# Altium project Quadcopter_REC.PrjPcb
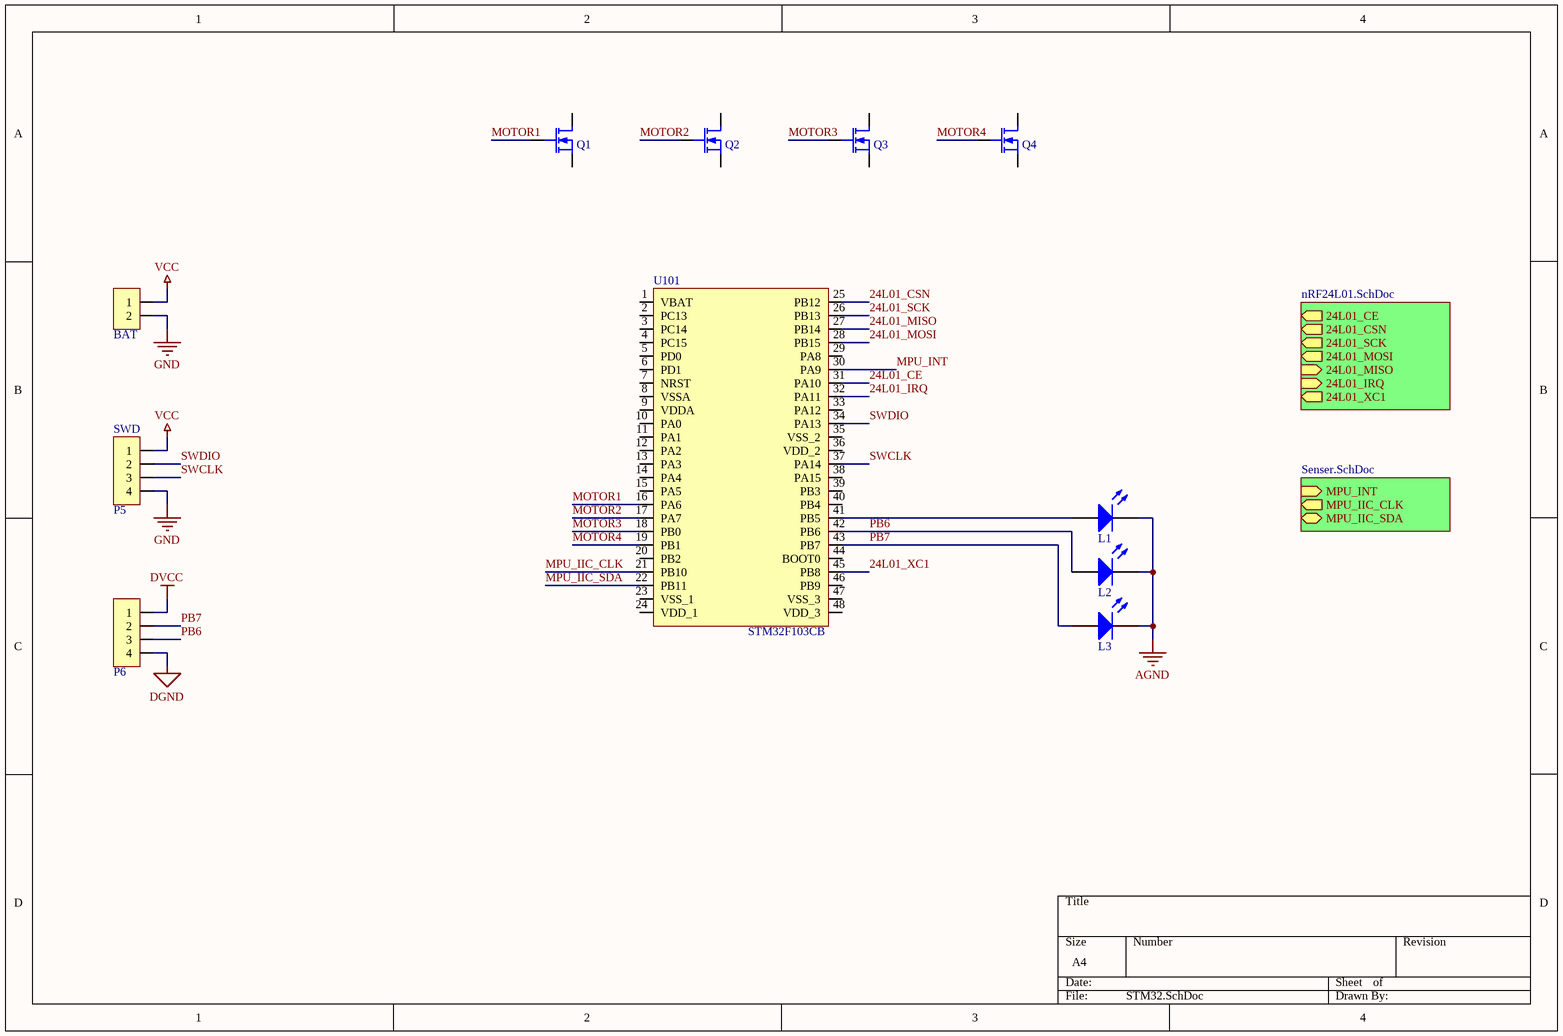
[diagram p0: STM32.SchDoc]
6 sheets, 26 parts. Net scope: hierarchical (ports join the sheet entries above them; power ports are global).
Board file: Quadcopter.PcbDoc
Sheets:
  STM32.SchDoc
    nRF24L01 = nRF24L01.SchDoc
    Senser = Senser.SchDoc
  Power.SchDoc
  Bluetooth.SchDoc
  Telecontroller.SchDoc

## Sheet STM32.SchDoc
size A4

### Parts
BAT  Port2  (value not drawn)
L1  LED  (value not drawn)
L2  LED  (value not drawn)
L3  LED  (value not drawn)
P5  SWD
P6  Port4  (value not drawn)
Q1  PWV31XN  (value not drawn)
Q2  PWV31XN  (value not drawn)
Q3  PWV31XN  (value not drawn)
Q4  PWV31XN  (value not drawn)
U101  STM32F103CB

### Sub-sheets
nRF24L01 = nRF24L01.SchDoc: 24L01_CE (out), 24L01_CSN (out), 24L01_SCK (out), 24L01_MOSI (out), 24L01_MISO (in), 24L01_IRQ (in), 24L01_XC1 (out)
Senser = Senser.SchDoc: MPU_INT (in), MPU_IIC_CLK (out), MPU_IIC_SDA (bidir)

### Nets
AGND: L1.2(K) L2.2(K) L3.2(K)
DGND: P6.4
DVCC: P6.1
GND: BAT.2 P5.4
VCC: BAT.1 P5.1
24L01_CE: U101.31(PA10)
24L01_CSN: U101.25(PB12)
24L01_IRQ: U101.32(PA11)
24L01_MISO: U101.27(PB14)
24L01_MOSI: U101.28(PB15)
24L01_SCK: U101.26(PB13)
24L01_XC1: U101.45(PB8)
MOTOR1: Q1.2(G) U101.16(PA6)
MOTOR2: Q2.2(G) U101.17(PA7)
MOTOR3: Q3.2(G) U101.18(PB0)
MOTOR4: Q4.2(G) U101.19(PB1)
MPU_IIC_CLK: U101.21(PB10)
MPU_IIC_SDA: U101.22(PB11)
MPU_INT: U101.30(PA9)
PB6: L2.1(A) P6.3 U101.42(PB6)
PB7: L3.1(A) P6.2 U101.43(PB7)
SWCLK: P5.3 U101.37(PA14)
SWDIO: P5.2 U101.34(PA13)
NetL1_1: L1.1(A) U101.41(PB5)

Not connected (* = marked no-connect by the designer): Q1 1(D) 3(S); Q2 1(D) 3(S); Q3 1(D) 3(S); Q4 1(D) 3(S); U101 1(VBAT) 2(PC13) 3(PC14) 4(PC15) 5(PD0) 6(PD1) 7(NRST) 8(VSSA) 9(VDDA) 10(PA0) 11(PA1) 12(PA2) 13(PA3) 14(PA4) 15(PA5) 20(PB2) 23(VSS_1) 24(VDD_1) 29(PA8) 33(PA12) 35(VSS_2) 36(VDD_2) 38(PA15) 39(PB3) 40(PB4) 44(BOOT0) 46(PB9) 47(VSS_3) 48(VDD_3)

### Library data of the parts
BAT = Port2: PowerSupply
P5 = Port4
U101 = STM32F103C8\CB

## Sheet nRF24L01.SchDoc
size A4
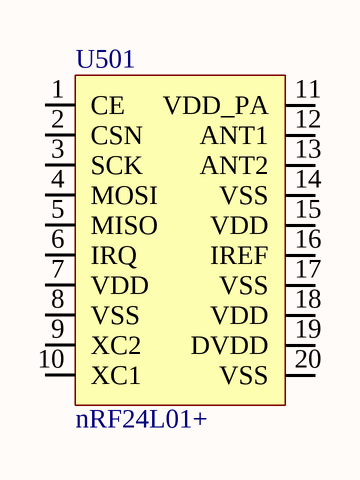
[diagram p1: nRF24L01.SchDoc]

### Parts
U501  nRF24L01+

### Nets

Not connected (* = marked no-connect by the designer): U501 1(CE) 2(CSN) 3(SCK) 4(MOSI) 5(MISO) 6(IRQ) 7(VDD) 8(VSS) 9(XC2) 10(XC1) 11(VDD_PA) 12(ANT1) 13(ANT2) 14(VSS) 15(VDD) 16(IREF) 17(VSS) 18(VDD) 19(DVDD) 20(VSS)

## Sheet Senser.SchDoc
size A4
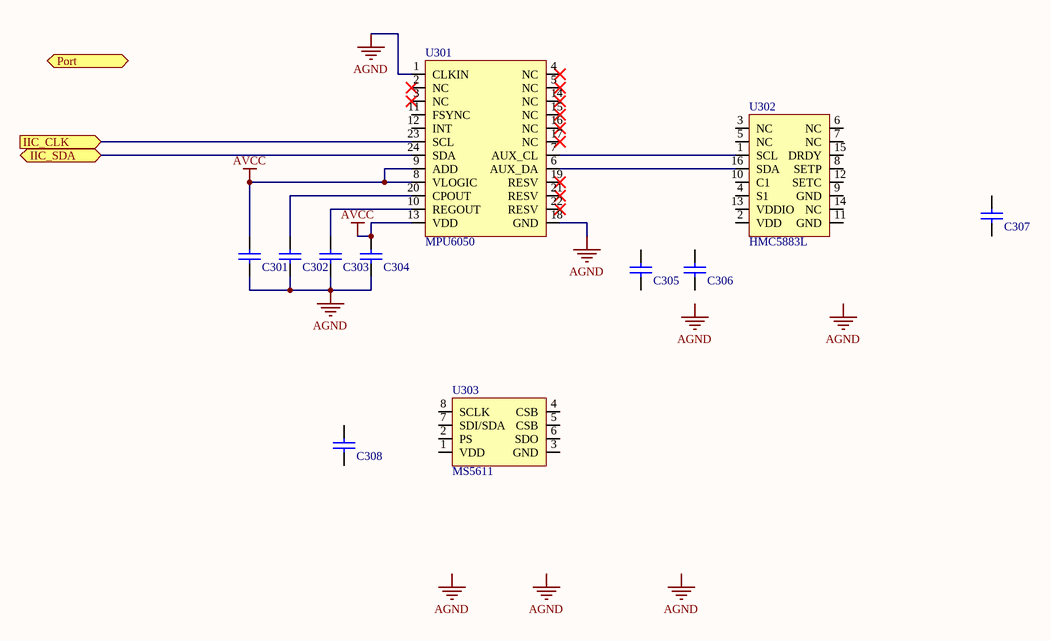
[diagram p2: Senser.SchDoc]

### Parts
C301  Cap 0603  (value not drawn)
C302  Cap 0603  (value not drawn)
C303  Cap 0603  (value not drawn)
C304  Cap 0603  (value not drawn)
C305  Cap 0603  (value not drawn)
C306  Cap 0603  (value not drawn)
C307  Cap 0603  (value not drawn)
C308  Cap 0603  (value not drawn)
U301  MPU6050
U302  HMC5883L
U303  MS5611

### Ports
IIC_CLK (in), IIC_SDA (bidir), Port

### Nets
AGND: C301.1 C302.1 C303.1 C304.1 U301.1(CLKIN) U301.18(GND)
AVCC: C301.2 C304.2 U301.8(VLOGIC) U301.9(ADD) U301.13(VDD)
NetC302_2: C302.2 U301.20(CPOUT)
NetC303_2: C303.2 U301.10(REGOUT)
NetU301_6: U301.6(AUX_DA) U302.16(SDA)
NetU301_7: U301.7(AUX_CL) U302.1(SCL)
NetU301_23: U301.23(SCL) ; port IIC_CLK
NetU301_24: U301.24(SDA) ; port IIC_SDA

Not connected (* = marked no-connect by the designer): C305 1 2; C306 1 2; C307 1 2; C308 1 2; U301 2(NC)* 3(NC)* 4(NC)* 5(NC)* 11(FSYNC) 12(INT) 14(NC)* 15(NC)* 16(NC)* 17(NC)* 19(RESV)* 21(RESV)* 22(RESV)*; U302 2(VDD) 3(NC) 4(S1) 5(NC) 6(NC) 7(NC) 8(SETP) 9(GND) 10(C1) 11(GND) 12(SETC) 13(VDDIO) 14(NC) 15(DRDY); U303 1(VDD) 2(PS) 3(GND) 4(CSB) 5(CSB) 6(SDO) 7(SDI/SDA) 8(SCLK)

### Notes on the sheet
- Labels drawn without touching a wire or pin: AGND

## Sheet Power.SchDoc
size A4
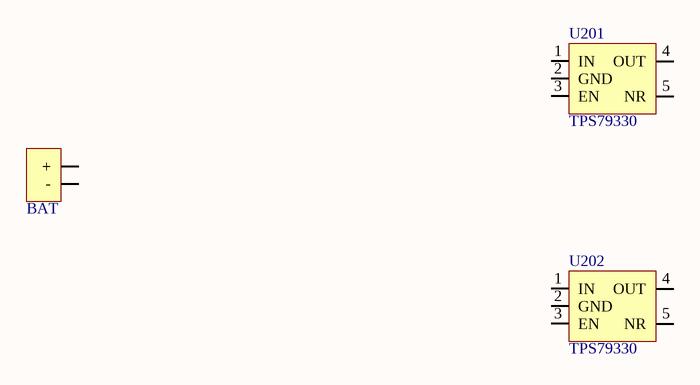
[diagram p3: Power.SchDoc]

### Parts
*  BAT
U201  TPS79330
U202  TPS79330

### Nets

Not connected (* = marked no-connect by the designer): * 1(+) 2(-); U201 1(IN) 2(GND) 3(EN) 4(OUT) 5(NR); U202 1(IN) 2(GND) 3(EN) 4(OUT) 5(NR)

### Library data of the parts
U201 U202 = TPS793??

## Sheet Bluetooth.SchDoc
size A4

## Sheet Telecontroller.SchDoc
size A4

## Nets that join several sheets
AGND: STM32 (L1.2 L2.2 L3.2), Senser (6 pins)